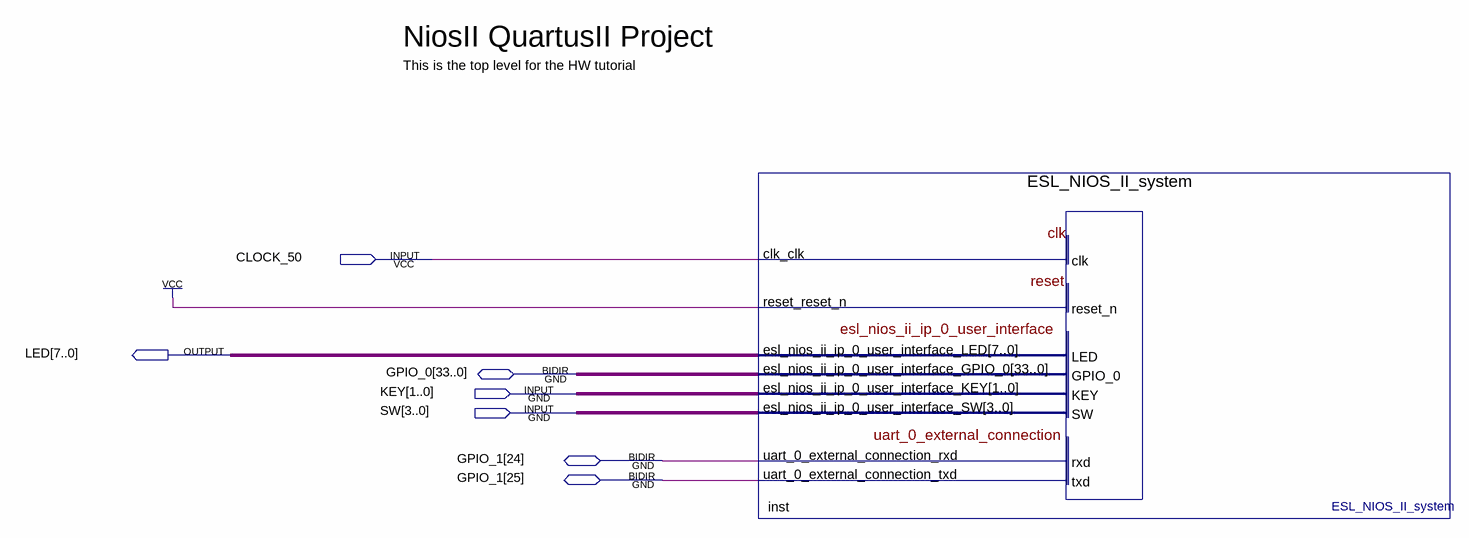
[diagram p0: schematic sheet]
// Quartus schematic ESL_2D_camera_tracker.bdf as structural Verilog: 1 symbols, 7 pins
module ESL_2D_camera_tracker (
  input  CLOCK_50,
  input  [1:0] KEY,
  input  [3:0] SW,
  inout  [33:0] GPIO_0,
  inout  [25:24] GPIO_1,
  output [7:0] LED
);

  ESL_NIOS_II_system inst (
    .clk_clk(CLOCK_50), .reset_reset_n(1'b1), .esl_nios_ii_ip_0_user_interface_KEY(KEY),
    .esl_nios_ii_ip_0_user_interface_SW(SW), .uart_0_external_connection_rxd(GPIO_1[24]),
    .esl_nios_ii_ip_0_user_interface_LED(LED), .uart_0_external_connection_txd(GPIO_1[25]),
    .esl_nios_ii_ip_0_user_interface_GPIO_0(GPIO_0));

  // Notes on the sheet:
  //   NiosII QuartusII Project
  //   This is the top level for the HW tutorial
endmodule
